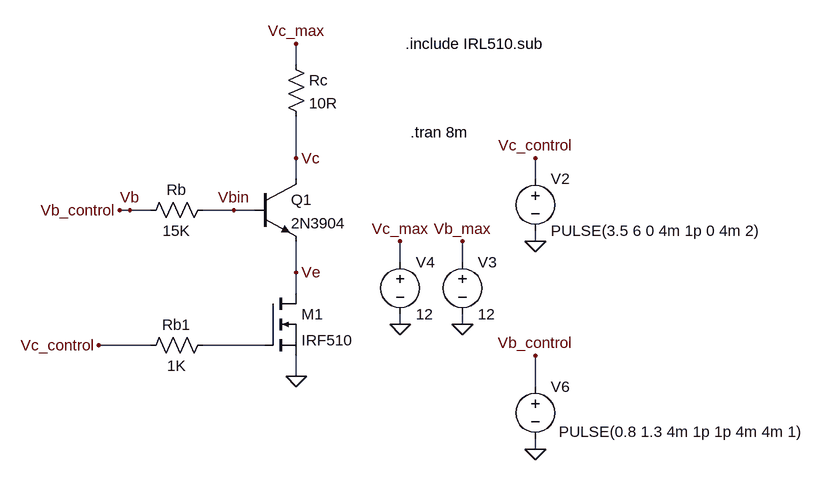
[diagram p0: schematic NPN FET Test Configuration.asc]
NPN FET Test Configuration.asc, the LTspice schematic file:
Version 4
SHEET 1 2524 804
WIRE 624 -272 624 -304
WIRE 624 -128 624 -192
WIRE 624 -96 624 -128
WIRE 992 -96 992 -128
WIRE 368 -48 352 -48
WIRE 400 -48 368 -48
WIRE 528 -48 480 -48
WIRE 560 -48 528 -48
WIRE 992 0 992 -16
WIRE 784 32 784 0
WIRE 880 32 880 0
WIRE 624 48 624 0
WIRE 624 80 624 48
WIRE 784 128 784 112
WIRE 880 128 880 112
WIRE 400 160 320 160
WIRE 576 160 480 160
WIRE 624 208 624 176
WIRE 992 224 992 176
WIRE 992 320 992 304
FLAG 624 208 0
FLAG 784 128 0
FLAG 624 -128 Vc
FLAG 368 -48 Vb
FLAG 784 0 Vc_max
FLAG 992 -128 Vc_control
FLAG 992 0 0
FLAG 992 176 Vb_control
FLAG 528 -48 Vbin
FLAG 352 -48 Vb_control
FLAG 880 128 0
FLAG 880 0 Vb_max
FLAG 992 320 0
FLAG 624 -304 Vc_max
FLAG 320 160 Vc_control
FLAG 624 48 Ve
SYMBOL npn 560 -96 R0
SYMATTR InstName Q1
SYMATTR Value 2N3904
SYMBOL voltage 784 16 R0
WINDOW 123 0 0 Left 2
WINDOW 39 0 0 Left 2
SYMATTR InstName V4
SYMATTR Value 12
SYMBOL res 496 -64 R90
WINDOW 0 0 56 VBottom 2
WINDOW 3 32 56 VTop 2
SYMATTR InstName Rb
SYMATTR Value 15K
SYMBOL voltage 992 -112 R0
WINDOW 123 0 0 Left 2
WINDOW 39 0 0 Left 2
SYMATTR InstName V2
SYMATTR Value PULSE(3.5 6 0 4m 1p 0 4m 2)
SYMBOL voltage 880 16 R0
WINDOW 123 0 0 Left 2
WINDOW 39 0 0 Left 2
SYMATTR InstName V3
SYMATTR Value 12
SYMBOL voltage 992 208 R0
WINDOW 123 0 0 Left 2
WINDOW 39 0 0 Left 2
WINDOW 3 36 85 Left 2
SYMATTR Value PULSE(0.8 1.3 4m 1p 1p 4m 4m 1)
SYMATTR InstName V6
SYMBOL res 608 -288 R0
SYMATTR InstName Rc
SYMATTR Value 10R
SYMBOL res 496 144 R90
WINDOW 0 0 56 VBottom 2
WINDOW 3 32 56 VTop 2
SYMATTR InstName Rb1
SYMATTR Value 1K
SYMBOL nmos 576 80 R0
SYMATTR InstName M1
SYMATTR Value IRF510
TEXT 800 -168 Left 2 !.tran 8m
TEXT 792 -304 Left 2 !.include IRL510.sub

The netlist it stands for:
* NPN FET Test Configuration.asc
Q1 Vc Vbin Ve 0 2N3904
V4 Vc_max 0 12
Rb Vbin Vb_control 15K
V2 Vc_control 0 PULSE(3.5 6 0 4m 1p 0 4m 2)
V3 Vb_max 0 12
V6 Vb_control 0 PULSE(0.8 1.3 4m 1p 1p 4m 4m 1)
Rc Vc_max Vc 10R
Rb1 N001 Vc_control 1K
M1 Ve N001 0 0 IRF510
.model NPN NPN
.model PNP PNP
.lib standard.bjt
.model NMOS NMOS
.model PMOS PMOS
.lib standard.mos
.tran 8m
.include IRL510.sub
.backanno
.end